# EasyEDA Pro project WearableGasDetect.epro, schematic Schematic6
Board Name: 换屏后主板; Create Date: 2025-04-30; Page Name: P1; Project Name: 25大创; Schematic Name: Schematic6; Update Date: 2025-05-06; Company: 嘉立创EDA; Page Size: A4; Version: V1.0
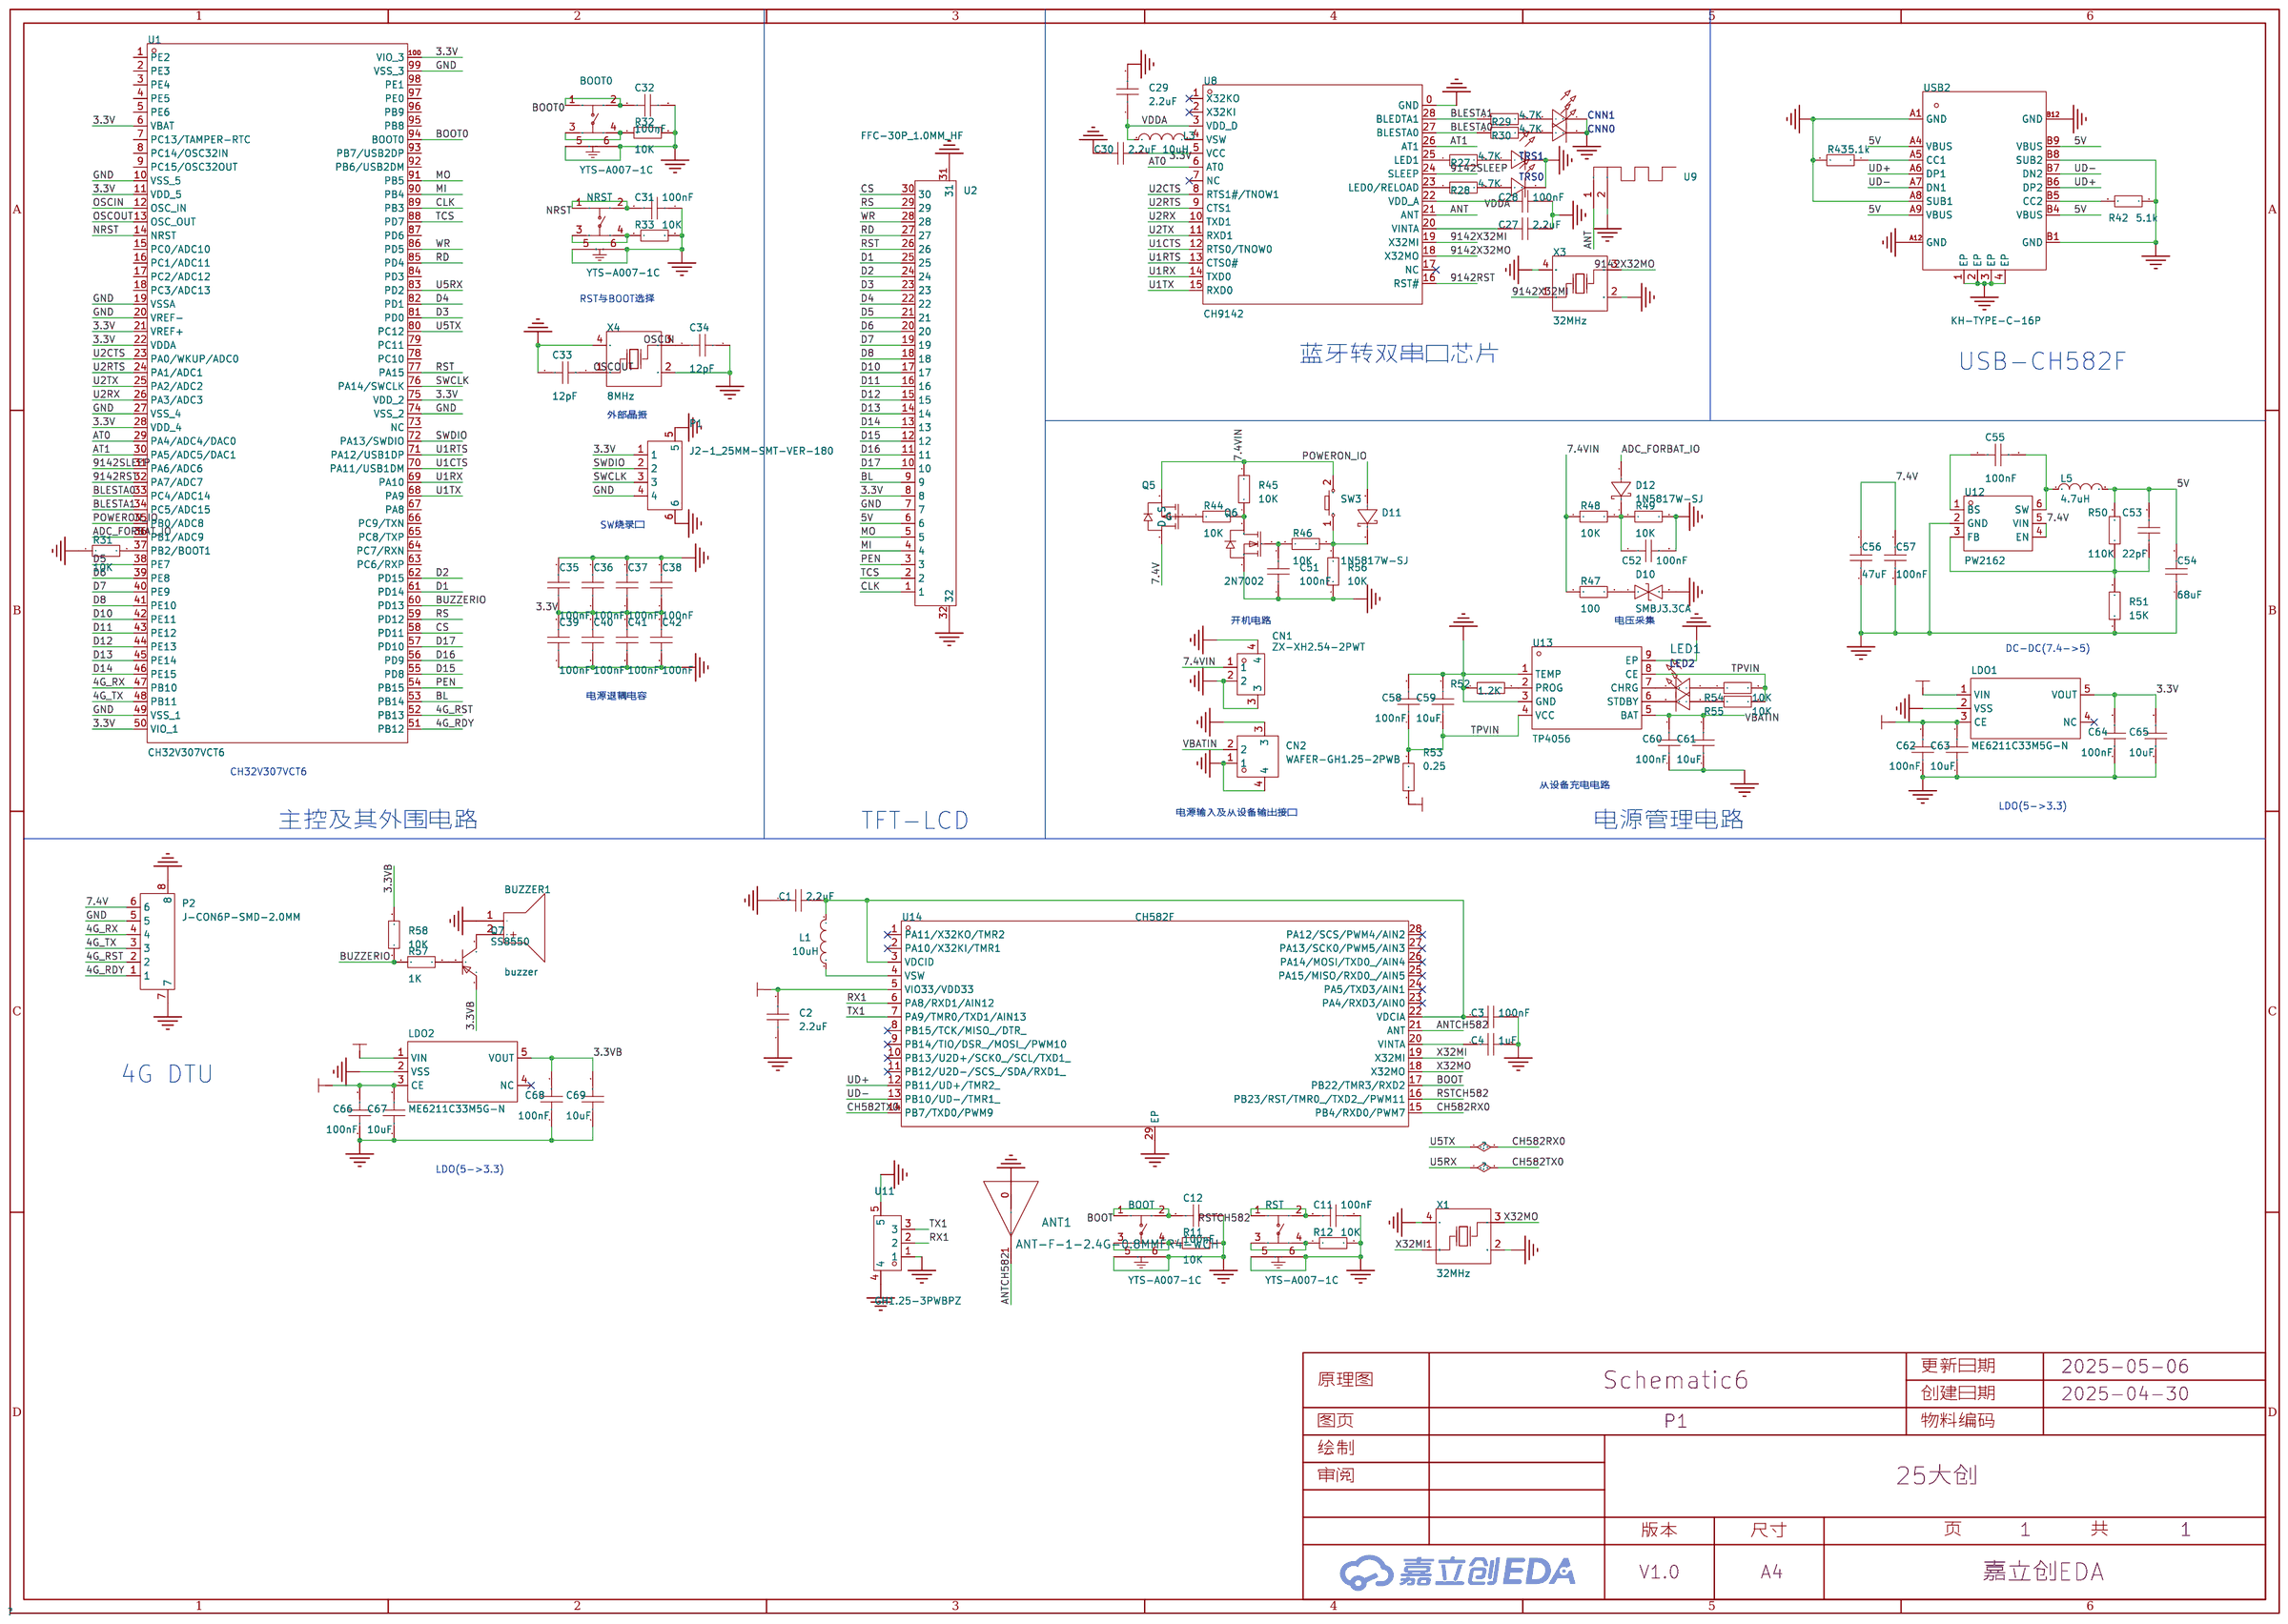
[diagram p4: schematic sheet]

## Parts
ANT1  ANT-F-1-2.4G-0.8MMFR4-WCH  [ANT-F-1-2.4G-0.8MMFR4-WCH]
BOOT  YTS-A007-1C  [SW-SMD_6P-L3.4-W3.4-P2.00-LS4.0]
BOOT0  YTS-A007-1C  [SW-SMD_6P-L3.4-W3.4-P2.00-LS4.0]
BUZZER1  buzzer  [BUZ-TH_BD12.0-P6.00-D0.9-RD]
C1  2.2uF  [C0402]
C2  2.2uF  [C0402]
C3  100nF  [C0402]
C4  1uF  [C0402]
C11  100nF  [C0402]
C12  100nF  [C0402]
C27  2.2uF  [C0402]
C28  100nF  [C0402]
C29  2.2uF  [C0402]
C30  2.2uF  [C0402]
C31  100nF  [C0402]
C32  100nF  [C0402]
C33  12pF  [C0402]
C34  12pF  [C0402]
C35  100nF  [C0603]
C36  100nF  [C0603]
C37  100nF  [C0603]
C38  100nF  [C0603]
C39  100nF  [C0603]
C40  100nF  [C0603]
C41  100nF  [C0603]
C42  100nF  [C0603]
C51  100nF  [C0603]
C52  100nF  [C0603]
C53  22pF  [C0603]
C54  68uF  [C0603]
C55  100nF  [C0603]
C56  47uF  [C0603]
C57  100nF  [C0603]
C58  100nF  [C0603]
C59  10uF  [C0805]
C60  100nF  [C0603]
C61  10uF  [C0805]
C62  100nF  [C0603]
C63  10uF  [C0603]
C64  100nF  [C0603]
C65  10uF  [C0603]
C66  100nF  [C0603]
C67  10uF  [C0603]
C68  100nF  [C0603]
C69  10uF  [C0603]
CN1  ZX-XH2.54-2PWT  [CONN-SMD_2P-P2.54_MEGASTAR_ZX-XH2.54-2PWT]
CN2  WAFER-GH1.25-2PWB  [CONN-TH_2P-P1.25_XUNPU_WAFER-GH1.25-2PWB]
CNN0  -  [LED_0402]
CNN1  -  [LED_0402]
D10  SMBJ3.3CA  [SMB_L4.4-W3.6-LS5.3-BI]
D11  1N5817W-SJ  [SOD-123_L2.8-W1.8-LS3.7-RD]
D12  1N5817W-SJ  [SOD-123_L2.8-W1.8-LS3.7-RD]
L1  10uH  [IND-SMD_L2.5-W2.0]
L3  10uH  [L0805]
L5  4.7uH  [IND-SMD_L4.0-W4.0-A]
LDO1  ME6211C33M5G-N  [SOT-23-5_L3.0-W1.7-P0.95-LS2.8-BL]
LDO2  ME6211C33M5G-N  [SOT-23-5_L3.0-W1.7-P0.95-LS2.8-BL]
LED1  -  [LED_0603]
LED2  -  [LED_0603]
NRST  YTS-A007-1C  [SW-SMD_6P-L3.4-W3.4-P2.00-LS4.0]
P1  J2-1_25MM-SMT-VER-180  [CONN-SMD_4P-P2.00-XH2.00-4P-WT]
P2  J-CON6P-SMD-2.0MM  [CONN-SMD_6P-P2.00-XH2.00-6P-WT]
Q5  -  [AO3401A_SOT-23-3]
Q6  2N7002  [SOT-23-3_L2.9-W1.3-P1.90-LS2.4-BR]
Q7  SS8550  [SOT-23-3_L2.9-W1.3-P1.90-LS2.4-BR]
R11  10K  [R0402]
R12  10K  [R0402]
R27  4.7K  [R0402]
R28  4.7K  [R0402]
R29  4.7K  [R0402]
R30  4.7K  [R0402]
R31  10K  [R0603]
R32  10K  [R0402]
R33  10K  [R0402]
R42  5.1k  [R0402]
R43  5.1k  [R0402]
R44  10K  [R0603]
R45  10K  [R0603]
R46  10K  [R0603]
R47  100  [R0603]
R48  10K  [R0603]
R49  10K  [R0603]
R50  110K  [R0603]
R51  15K  [R0603]
R52  1.2K  [R0603]
R53  0.25  [R0603]
R54  10K  [R0603]
R55  10K  [R0603]
R56  10K  [R0603]
R57  1K  [R0603]
R58  10K  [R0603]
RST  YTS-A007-1C  [SW-SMD_6P-L3.4-W3.4-P2.00-LS4.0]
SW3  -  [Key_SMD_3x4x2]
TRS0  -  [LED_0402]
TRS1  -  [LED_0402]
U1  CH32V307VCT6  [LQFP-100_L14.0-W14.0-P0.50-LS16.0-BL]
U2  FFC-30P_1.0MM_HF  [FPC-SMD_30P-P1.00_C9900049190]
U8  CH9142  [QFN-28_L4.0-W4.0-P0.40-BL-EP2.7_CH9142]
U9  -  [通用蓝牙天线]
U11  GH1.25-3PWBPZ  [CONN-SMD_GH1.25-3PWBPZ]
U12  PW2162  [SOT-23-6_L2.9-W1.6-P0.95-LS2.8-BL]
U13  TP4056  [ESOP-8_L4.9-W3.9-P1.27-LS6.0-BL-EP]
U14  CH582F  [QFN-28_L4.0-W4.0-P0.40-BL-EP2.8]
USB2  KH-TYPE-C-16P  [USB-C-SMD_KH-TYPE-C-16P]
X1  32MHz  [CRYSTAL-SMD_4P-L3.2-W2.5-BL]
X3  32MHz  [CRYSTAL-SMD_4P-L3.2-W2.5-BL]
X4  8MHz  [CRYSTAL-SMD_4P-L3.2-W2.5-BL]

## Library data of the parts
ANT1 = ANT-F-1-2.4G-0.8MMFR4-WCH
BOOT BOOT0 NRST RST = YTS-A007-1C: 电路结构:单刀单掷;按钮形状:圆形按钮;作用力:160gf;安装方式:立贴;开关长度:3.4mm;开关宽度:3.35mm;开关高度:2mm;带支架:不带;触点电流:50mA;额定电压(DC):12V;绝缘电阻:100MΩ;机械寿命:10万次;; LCSC Part Name: 3.4*3.35*2mm 立贴 轻触开关; Supplier Part: C2910660; Manufacturer: YIYUAN(怡远); Supplier Footprint: SMD; Datasheet: https://atta.szlcsc.com/upload/public/pdf/source/20211115/F701EB4F96D863066ABC82C6FE41162B.pdf; Supplier: LCSC; Circuit: 单刀单掷; Actuator Style: 圆形按钮; Operating Force: 160gf; Mounting Style: 立贴; Switch Length: 3.4mm; Switch Width: 3.35mm; Switch Height: 2mm; Strike Gundam: 不带; Contact Current: 50mA; Voltage Rating (DC): 12V; Insulation Resistance: 100MΩ; Actuator/Cap Color: 黑色; Pin Style: SMD接片; Mechanical Life: 10万次
BUZZER1 = buzzer: Supplier Part: C9900014030; JLCPCB Part Class: 扩展库; Supplier: LCSC
C1-C4 C11 C12 C27-C34 = CAP_0402: Supplier Footprint: 0402
C35-C42 C51-C58 C60 C62-C69 = CAP_0603: Supplier Footprint: 0603
C59 C61 = CAP_0805: Supplier Footprint: 0805
CN1 = ZX-XH2.54-2PWT: 插针结构:1x2P;间距:2.5mm;安装方式:卧贴;参考系列:XH;总PIN数:2P;排数:1;每排PIN数:2;行距:-;额定电流:-;触头材质:黄铜;触头镀层:锡;工作温度范围:-;; LCSC Part Name: 1x2P 间距:2.5mm 卧贴 系列:XH; Supplier Part: C7429671; Manufacturer: Megastar(兆星); Supplier Footprint: SMD,P=2.5mm,卧贴; Datasheet: https://atta.szlcsc.com/upload/public/pdf/source/20230619/D2020A0565D707024C90AEAD14B7AF42.pdf; Supplier: LCSC; Pins Structure: 1x2P; Pitch: 2.5mm; Mounting Type: 卧贴; Reference Series: XH; Number of Pins: 2P; Number of Rows: 1; Number of PINs Per Row: 2; Contact Material: 黄铜; Contact Plating: 锡; Supplementary Features: 辅助焊脚; Color: 米色; Z-Height of the Board: 6.2mm; X-Length of Bottom Edge on Board (Spacing Line): 10mm; Y-Width of Bottom Edge on Board: 10.5mm
CN2 = WAFER-GH1.25-2PWB: 插针结构:1x2P;间距:1.25mm;安装方式:卧贴;参考系列:GH;总PIN数:2P;排数:1;每排PIN数:2;行距:-;额定电流:1A;触头材质:黄铜;触头镀层:-;工作温度范围:-25℃~+85℃;; LCSC Part Name: 1x2P 间距:1.25mm 卧贴 系列:GH; Supplier Part: C3029377; Manufacturer: XUNPU(讯普); Supplier Footprint: SMD,P=1.25mm,卧贴; Datasheet: https://atta.szlcsc.com/upload/public/pdf/source/20220527/CB8773BFB0913C3B8ABD62CB38BA101A.pdf; Supplier: LCSC; Pins Structure: 1x2P; Pitch: 1.25mm; Mounting Type: 卧贴; Reference Series: GH; Number of Pins: 2P; Number of Rows: 1; Number of PINs Per Row: 2; Current Rating: 1A; Contact Material: 黄铜; Operating Temperature: -25℃~+85℃; Voltage Rating: 125V; Plastic Material: LCP; Supplementary Features: 辅助焊脚; Color: 米色; Z-Height of the Board: 4.35mm; X-Length of Bottom Edge on Board (Spacing Line): 5.75mm; Y-Width of Bottom Edge on Board: 5mm
CNN0 CNN1 TRS0 TRS1 = LED_0402-B: Supplier Footprint: 0402
D10 = SMBJ3.3CA: 反向截止电压(Vrwm):3.3V;钳位电压:8.2V;峰值脉冲电流(Ipp):50A;击穿电压:4.6V;; Supplier Part: C2917866; Manufacturer: ZHIDE(志得); Supplier Footprint: SMB; JLCPCB Part Class: 扩展库; Datasheet: https://atta.szlcsc.com/upload/public/pdf/source/20211210/F4F2038B8CEFA168E8A0B49C38D82F52.pdf; Supplier: LCSC; Reverse Stand-Off Voltage (Vrwm): 3.3V; Clamping Voltage: 8.2V; Peak Pulse Current (Ipp): 50A; Voltage - Breakdown: 4.6V; Reverse Leakage Current (Ir): 2mA; Type: TVS
D11 D12 = 1N5817W-SJ: 二极管配置：独立式 直流反向耐压(Vr)：20V 平均整流电流(Io)：1A 正向压降(Vf)：750mV@3A; Supplier Part: C5457042; Manufacturer: SY(顺烨); Supplier Footprint: SOD-123; JLCPCB Part Class: 扩展库; Supplier: LCSC
L1 = FTC252012S100MBCA: 电感值:10uH;精度:±20%;额定电流:1.2A;饱和电流(Isat):1.6A;类型:一体成型电感;; LCSC Part Name: 10uH ±20% 1.6A; Supplier Part: C5832376; Manufacturer: cjiang(长江微电); Supplier Footprint: SMD,2x2.5mm; Datasheet: https://atta.szlcsc.com/upload/public/pdf/source/20230602/8FFEDA9C0247A92A0D4B67554BFE4091.pdf; Supplier: LCSC; Tolerance: ±20%; Rated Current: 1.2A; Saturation Current (Isat): 1.6A; DC Resistance (DCR): 330mΩ; Type: 一体成型电感
L3 = L_0805
L5 = XFL4020-152MEC: 电感值:1.5uH;精度:±20%;额定电流:-;饱和电流(Isat):-;类型:-;; LCSC Part Name: 1.5uH ±20%; Supplier Part: C3033018; Manufacturer: Coilcraft(线艺); Supplier Footprint: SMD,4x4mm; Supplier: LCSC; Tolerance: ±20%
LDO1 LDO2 = ME6211C33M5G-N: 输出类型:固定;工作电压:6V;输出电压:3.3V;输出电流:500mA;电源纹波抑制比(PSRR):70dB@(1kHz)；62dB@(10kHz);输出极性:正极;; LCSC Part Name: 输入6V 输出3.3V 500mA; Supplier Part: C82942; Manufacturer: MICRONE(南京微盟); Supplier Footprint: SOT-23-5; Datasheet: https://atta.szlcsc.com/upload/public/pdf/source/20170918/C82942_1505727073070976520.pdf; Supplier: LCSC; Output Type: 固定; Voltage - Supply: 6V; Output Voltage: 3.3V; Output Current: 500mA; Power Supply Rejection Ratio (PSRR): 70dB@(1kHz)；62dB@(10kHz); Voltage Dropout: 260mV@(200mA); Features: 短路保护(SCP)；低ESR；过流保护(OCP)；带使能; Output Configuration: 正极; Number of Outputs: 1
LED1 = LED_0603-R: Supplier Footprint: 0603
LED2 = LED_0603-G: Supplier Footprint: 0603
P1 = J2-1_25MM-SMT-VER-180: Supplier Part: C9900010379; JLCPCB Part Class: 扩展库; Supplier: LCSC
P2 = J-CON6P-SMD-2.0MM: Supplier Part: C9900003967; Supplier Footprint: R232-A; JLCPCB Part Class: 扩展库; Supplier: LCSC
Q5 = AO3401A_P: Supplier Footprint: SOT-23-3L; Supplier Part: C15127; JLCPCB Part Class: 基础库
Q6 = 2N7002: 类型:1个N沟道;漏源电压(Vdss):60V;连续漏极电流(Id):115mA;导通电阻(RDS(on)@Vgs,Id):7.5Ω@10V,500mA;功率:200mW;阈值电压(Vgs(th)@Id):2.5V@250uA;; LCSC Part Name: 1个N沟道 耐压:60V 电流:115mA; Supplier Part: C727149; Manufacturer: TWGMC(台湾迪嘉); Supplier Footprint: SOT-23; JLCPCB Part Class: 扩展库; Datasheet: https://atta.szlcsc.com/upload/public/pdf/source/20200827/C727149_F88DE2A79720D5B1ACE833184507B038.pdf; Supplier: LCSC; Type: 1个N沟道; Drain Source Voltage (Vdss): 60V; Continuous Drain Current (Id): 115mA; Drain Source On Resistance (RDS(on)@Vgs,Id): 7.5Ω@10V,500mA; Power Dissipation (Pd): 200mW; Gate Threshold Voltage (Vgs(th)@Id): 2.5V@250uA; Input Capacitance (Ciss@Vds): 50pF@25V; Reverse Transfer Capacitance (Crss@Vds): 5pF@25V; Operating Temperature: -55℃~+150℃
Q7 = SS8550: LCSC Part Name: PNP -25V -1.5A 120-400 SOT-23; Supplier Part: C2931718; Manufacturer: Doeshare(德芯); Supplier Footprint: SOT-23; JLCPCB Part Class: 扩展库; Datasheet: https://atta.szlcsc.com/upload/public/pdf/source/20220104/E36293975455CDB0A899354BE4C8E85F.pdf; Supplier: LCSC
R11 R12 R27-R30 R32 R33 R42 R43 = Res_0402: Supplier Footprint: 0402
R31 R44-R58 = Res_0603: Supplier Footprint: 0603
SW3 = Key_SMD_3x4x2: Supplier Footprint: SMD
U1 = CH32V307VCT6: CPU内核:RISC-V;程序存储容量:256KB;RAM总容量:64KB;GPIO端口数量:80;工作电压范围:2.5V~3.3V;CPU最大主频:144MHz;程序存储器类型:FLASH;应用领域:-;; Supplier Part: C2943979; Manufacturer: WCH(南京沁恒); Supplier Footprint: LQFP-100(14x14); JLCPCB Part Class: 扩展库; Datasheet: https://atta.szlcsc.com/upload/public/pdf/source/20220111/249074F152243A2E6E0364BFD3BF5289.pdf; Supplier: LCSC; CPU Core: RISC-V; Program Storage Size: 256KB; RAM Size: 64KB; GPIO Ports Number: 80; Operating Voltage Range: 2.5V~3.3V; CPU Maximum Speed: 144MHz; Program Memory Type: FLASH; Operating Temperature Range: -40℃~+85℃; ADC (Bit): 12bit; DAC (Bit): 12bit; PWM (Bit): 16bit; 16Bit Timer: 10; CAN: 2; UART/USART: 8; I2C: 2; I2S: 2; SPI: 3; Universal Serial Bus: 有; Internal Comparator: 有; Watchdog: 有; Real-Time Clock: 有; Infrared Data Association: 有; Low-Voltage Detect: 有; CCP Capture/Compare: 有; LCD Module: 有; Secure Digital Input and Output: 有; Direct Memory Access: 有; Internal Oscillator: 有
U2 = FFC-30P_1.0MM_HF: Supplier Part: C9900049190; Supplier Footprint: SMD-30P; JLCPCB Part Class: 扩展库; Supplier: LCSC
U8 = CH9142: 接口:SPI；UART;应用领域:蓝牙;数据速率:1Mbps;; Supplier Part: C39831289; Manufacturer: WCH(南京沁恒); Supplier Footprint: QFN-28(4x4); JLCPCB Part Class: 扩展库; Datasheet: https://atta.szlcsc.com/upload/public/pdf/source/20240807/14B997D2025695D367C6ADC3BA92D1D2.pdf; Supplier: LCSC; Interface: SPI；UART; Operating Voltage: 2.3V~3.6V; Applications: 蓝牙; Output Power: -20dBm; Data Rate: 1Mbps; Operating Temperature: -40℃~+85℃
U9 = 蓝牙天线: _: undefined
U11 = GH1.25-3PWBPZ: LCSC Part Name: GH1.25-3P卧贴编带; Supplier Part: C2829252; Manufacturer: BOOMELE(博穆精密); JLCPCB Part Class: 扩展库; Datasheet: https://atta.szlcsc.com/upload/public/pdf/source/20211125/08A09A4909F58AF780B71FE423A00F7E.pdf; Supplier: LCSC
U12 = PW2162: Supplier Part: C9900006107; Supplier Footprint: SOT-23-6L; JLCPCB Part Class: 扩展库; Supplier: LCSC
U13 = TP4056: Supplier Part: C9900002169; Supplier Footprint: ESOP-8; JLCPCB Part Class: 扩展库; Supplier: LCSC
U14 = CH582F: Supplier Part: C3001175; Manufacturer: WCH(南京沁恒); Supplier Footprint: QFN-28-EP(4x4); Datasheet: https://atta.szlcsc.com/upload/public/pdf/source/20220425/D81D4537E275CD6C7C3E77BC95B144F3.pdf; Supplier: LCSC
USB2 = KH-TYPE-C-16P: 连接器类型:Type-C;标准:-;公母:母;端口数量:1;触点数量:16P;安装方式:卧贴;额定电流 - 电源:3A;工作温度范围:-40℃~+85℃;; LCSC Part Name: Type-C 母 卧贴; Supplier Part: C709357; Manufacturer: kinghelm(金航标); Supplier Footprint: SMD; Datasheet: https://atta.szlcsc.com/upload/public/pdf/source/20200911/C709357_AA8DCEB38BB20E3035A7ED7AE7667837.pdf; Supplier: LCSC; Connector Type: Type-C; Gender: 母; Number of Ports: 1; Number of Contacts: 16P; Mounting Style: 卧贴; Current Rating - Power (Max): 3A; Operating Temperature Range: -40℃~+85℃
X1 X3 X4 = X322532MOB4SI: 晶振类型:贴片晶振;频率:32MHz;常温频差:±10ppm;外接负载电容:12pF;频率稳定度(全温):±20ppm;; LCSC Part Name: 32MHz ±10ppm 12pF; Supplier Part: C9009; Manufacturer: YXC(扬兴晶振); Supplier Footprint: SMD3225-4P; Datasheet: https://atta.szlcsc.com/upload/public/pdf/source/20240329/19D5F850207469550BEB00D7DFEDBC7A.pdf; Supplier: LCSC; Crystal Type: 贴片晶振; Normal temperature Frequency Tolerance: ±10ppm; External load capacitor: 12pF; Frequency Stability(Full temperature range): ±20ppm; Operating Temperature: -40℃~+85℃

## Nets
3.3V: C2.2 C30.2 C35.1 C36.1 C37.1 C38.1 C39.2 C40.2 C41.2 C42.2 C64.2 C65.2 LDO1.5(VOUT) P1.1 U1.6(VBAT) U1.11(VDD_5) U1.21(VREF+) U1.22(VDDA) U1.28(VDD_4) U1.50(VIO_1) U1.75(VDD_2) U1.100(VIO_3) U2.8 U8.5(VCC) U14.5(VIO33/VDD33)
3.3VB: C68.2 C69.2 LDO2.5(VOUT) Q7.2(E) R58.2
5V: C53.2 C54.2 C62.2 C63.2 C66.2 C67.2 L5.2 LDO1.1(VIN) LDO1.3(CE) LDO2.1(VIN) LDO2.3(CE) R50.2 R53.1 U2.6 USB2.A4(VBUS) USB2.A9(VBUS) USB2.B4(VBUS) USB2.B9(VBUS)
7.4V: C56.2 C57.2 P2.6 Q5.3(D) U12.4(EN) U12.5(VIN)
7.4VIN: CN1.1 Q5.2(S) R45.2 R47.1 R48.1 SW3.2
GND: ANT1.0(GND) BOOT.5(GND) BOOT.6(GND) BOOT0.5(GND) BOOT0.6(GND) BUZZER1.1(-) C1.1 C2.1 C3.2 C4.2 C11.1 C12.1 C27.2 C28.2 C29.2 C30.1 C31.1 C32.1 C33.1 C34.2 C35.2 C36.2 C37.2 C38.2 C39.1 C40.1 C41.1 C42.1 C51.1 C52.2 C54.1 C56.1 C57.1 C58.2 C59.2 C60.1 C61.1 C62.1 C63.1 C64.1 C65.1 C66.1 C67.1 C68.1 C69.1 CN1.2 CN1.3 CN1.4 CN2.1 CN2.3 CN2.4 CNN0.1(C) CNN1.1(C) D10.2 LDO1.2(VSS) LDO2.2(VSS) NRST.5(GND) NRST.6(GND) P1.4 P1.5 P1.6 P2.5 P2.7 P2.8 Q6.2(S) R11.2 R12.2 R31.1 R32.2 R33.2 R42.1 R43.2 R49.2 R51.1 R52.1 R56.1 RST.5(GND) RST.6(GND) TRS0.1(C) TRS1.1(C) U1.10(VSS_5) U1.19(VSSA) U1.20(VREF-) U1.27(VSS_4) U1.49(VSS_1) U1.74(VSS_2) U1.99(VSS_3) U2.7 U2.31 U2.32 U8.0(GND) U9.2 U11.1 U11.4 U11.5 U12.2(GND) U13.1(TEMP) U13.3(GND) U13.9(EP) U14.29(EP) USB2.1(EP) USB2.2(EP) USB2.3(EP) USB2.4(EP) USB2.A1(GND) USB2.A8(SUB1) USB2.A12(GND) USB2.B1(GND) USB2.B8(SUB2) USB2.B12(GND) X1.2(GND) X1.4(GND) X3.2(GND) X3.4(GND) X4.2(GND) X4.4(GND)
VBATIN: C60.2 C61.2 CN2.2 U13.5(BAT)
VDDA: C28.1 C29.1 L3.1 U8.3(VDD_D) U8.22(VDD_A)
4G_RDY: P2.1 U1.51(PB12)
4G_RST: P2.2 U1.52(PB13)
4G_RX: P2.4 U1.47(PB10)
4G_TX: P2.3 U1.48(PB11)
9142RST: U1.32(PA7/ADC7) U8.16(RST#)
9142SLEEP: U1.31(PA6/ADC6) U8.24(SLEEP)
9142X32MI: U8.19(X32MI) X3.1(OSC1)
9142X32MO: U8.18(X32MO) X3.3(OSC2)
ADC_FORBAT_IO: D12.2(A) U1.36(PB1/ADC9)
ANT: U8.21(ANT) U9.1
ANTCH582: ANT1.1 U14.21(ANT)
AT0: U1.29(PA4/ADC4/DAC0) U8.6(AT0)
AT1: U1.30(PA5/ADC5/DAC1) U8.26(AT1)
BL: U1.53(PB14) U2.9
BLESTA0: R30.1 U1.33(PC4/ADC14) U8.27(BLESTA0)
BLESTA1: R29.1 U1.34(PC5/ADC15) U8.28(BLEDTA1)
BOOT: BOOT.1 BOOT.2 C12.2 U14.17(PB22/TMR3/RXD2)
BOOT0: BOOT0.1 BOOT0.2 C32.2 U1.94(BOOT0)
BUZZERIO: R57.1 R58.1 U1.60(PD13)
CH582RX0: U1.80(PC12) U14.15(PB4/RXD0/PWM7)
CH582TX0: U1.83(PD2) U14.14(PB7/TXD0/PWM9)
CLK: U1.89(PB3) U2.1
CS: U1.58(PD11) U2.30
D1: U1.61(PD14) U2.25
D2: U1.62(PD15) U2.24
D3: U1.81(PD0) U2.23
D4: U1.82(PD1) U2.22
D5: U1.38(PE7) U2.21
D6: U1.39(PE8) U2.20
D7: U1.40(PE9) U2.19
D8: U1.41(PE10) U2.18
D10: U1.42(PE11) U2.17
D11: U1.43(PE12) U2.16
D12: U1.44(PE13) U2.15
D13: U1.45(PE14) U2.14
D14: U1.46(PE15) U2.13
D15: U1.55(PD8) U2.12
D16: U1.56(PD9) U2.11
D17: U1.57(PD10) U2.10
MI: U1.90(PB4) U2.4
MO: U1.91(PB5) U2.5
NRST: C31.2 NRST.1 NRST.2 U1.14(NRST)
OSCIN: C34.1 U1.12(OSC_IN) X4.3(OSC2)
OSCOUT: C33.2 U1.13(OSC_OUT) X4.1(OSC1)
PEN: U1.54(PB15) U2.3
POWERON_IO: D11.2(A) U1.35(PB0/ADC8)
RD: U1.85(PD4) U2.27
RS: U1.59(PD12) U2.29
RST: U1.77(PA15) U2.26
RSTCH582: C11.2 RST.1 RST.2 U14.16(PB23/RST/TMR0_/TXD2_/PWM11)
RX1: U11.2 U14.6(PA8/RXD1/AIN12)
SWCLK: P1.3 U1.76(PA14/SWCLK)
SWDIO: P1.2 U1.72(PA13/SWDIO)
TCS: U1.88(PD7) U2.2
TPVIN: C58.1 C59.1 R53.2 R54.2 R55.2 U13.4(VCC) U13.8(CE)
TX1: U11.3 U14.7(PA9/TMR0/TXD1/AIN13)
U1CTS: U1.70(PA11/USB1DM) U8.12(RTS0/TNOW0)
U1RTS: U1.71(PA12/USB1DP) U8.13(CTS0#)
U1RX: U1.69(PA10) U8.14(TXD0)
U1TX: U1.68(PA9) U8.15(RXD0)
U2CTS: U1.23(PA0/WKUP/ADC0) U8.8(RTS1#/TNOW1)
U2RTS: U1.24(PA1/ADC1) U8.9(CTS1)
U2RX: U1.26(PA3/ADC3) U8.10(TXD1)
U2TX: U1.25(PA2/ADC2) U8.11(RXD1)
UD+: U14.12(PB11/UD+/TMR2_) USB2.A6(DP1) USB2.B6(DP2)
UD-: U14.13(PB10/UD-/TMR1_) USB2.A7(DN1) USB2.B7(DN2)
WR: U1.86(PD5) U2.28
X32MI: U14.19(X32MI) X1.1(OSC1)
X32MO: U14.18(X32MO) X1.3(OSC2)
$1N8091: R27.1 U8.25(LED1)
$1N8092: R28.1 U8.23(LED0/RELOAD)
$1N8093: R28.2 TRS0.2(A)
$1N8094: R27.2 TRS1.2(A)
$1N8100: CNN1.2(A) R29.2
$1N8101: CNN0.2(A) R30.2
$1N8113: C27.1 U8.20(VINTA)
$1N8123: L3.2 U8.4(VSW)
$1N8435: NRST.3 NRST.4 R33.1
$1N8439: BOOT0.3 BOOT0.4 R32.1
$1N10591: R42.2 USB2.B5(CC2)
$1N10593: R43.1 USB2.A5(CC1)
$1N20960: Q5.1(G) R44.1
$1N20961: Q6.3(D) R44.2 R45.1
$1N20965: C51.2 Q6.1(G) R46.1
$1N20966: D11.1(C) R46.2 R56.2 SW3.1
$1N20968: D10.1 R47.2
$1N20976: C52.1 D12.1(C) R48.2 R49.1
$1N20980: C53.1 R50.1 R51.2 U12.3(FB)
$1N21005: C55.2 L5.1 U12.6(SW)
$1N21010: C55.1 U12.1(BS)
$1N21026: R52.2 U13.2(PROG)
$1N21036: LED2.1(C) U13.6(STDBY)
$1N21038: LED1.1(C) U13.7(CHRG)
$1N21040: LED1.2(A) R54.1
$1N21042: LED2.2(A) R55.1
$1N21511: R31.2 U1.37(PB2/BOOT1)
$1N24624: Q7.1(B) R57.2
$1N24626: BUZZER1.2(+) Q7.3(C)
$1N27314: C1.2 C3.1 L1.1 U14.3(VDCID) U14.22(VDCIA)
$1N27321: C4.1 U14.20(VINTA)
$1N27328: L1.2 U14.4(VSW)
$1N27721: BOOT.3 BOOT.4 R11.1
$1N27722: R12.1 RST.3 RST.4

Not connected (* = marked no-connect by the designer): LDO1 4(NC)*; LDO2 4(NC)*; U1 1(PE2) 2(PE3) 3(PE4) 4(PE5) 5(PE6) 7(PC13/TAMPER-RTC) 8(PC14/OSC32IN) 9(PC15/OSC32OUT) 15(PC0/ADC10) 16(PC1/ADC11) 17(PC2/ADC12) 18(PC3/ADC13) 63(PC6/RXP) 64(PC7/RXN) 65(PC8/TXP) 66(PC9/TXN) 67(PA8) 73(NC) 78(PC10) 79(PC11) 84(PD3) 87(PD6) 92(PB6/USB2DM) 93(PB7/USB2DP) 95(PB8) 96(PB9) 97(PE0) 98(PE1); U8 1(X32KO)* 2(X32KI)* 7(NC)* 17(NC)*; U14 1(PA11/X32KO/TMR2)* 2(PA10/X32KI/TMR1)* 8(PB15/TCK/MISO_/DTR_)* 9(PB14/TIO/DSR_/MOSI_/PWM10)* 10(PB13/U2D+/SCK0_/SCL/TXD1_)* 11(PB12/U2D-/SCS_/SDA/RXD1_)* 23(PA4/RXD3/AIN0)* 24(PA5/TXD3/AIN1)* 25(PA15/MISO/RXD0_/AIN5)* 26(PA14/MOSI/TXD0_/AIN4)* 27(PA13/SCK0/PWM5/AIN3)* 28(PA12/SCS/PWM4/AIN2)*

## Notes on the sheet
- RST与BOOT选择
- 蓝牙转双串口芯片
- USB-CH582F
- 外部晶振
- SW烧录口
- 开机电路
- 电压采集
- DC-DC(7.4->5)
- 电源退耦电容
- CH32V307VCT6
- 从设备充电电路
- 电源输入及从设备输出接口
- LDO(5->3.3)
- 主控及其外围电路
- TFT-LCD
- 电源管理电路
- 4G DTU
- LDO(5->3.3)
